# Altium project BrushMotor6_DEMO_0.PrjPcb
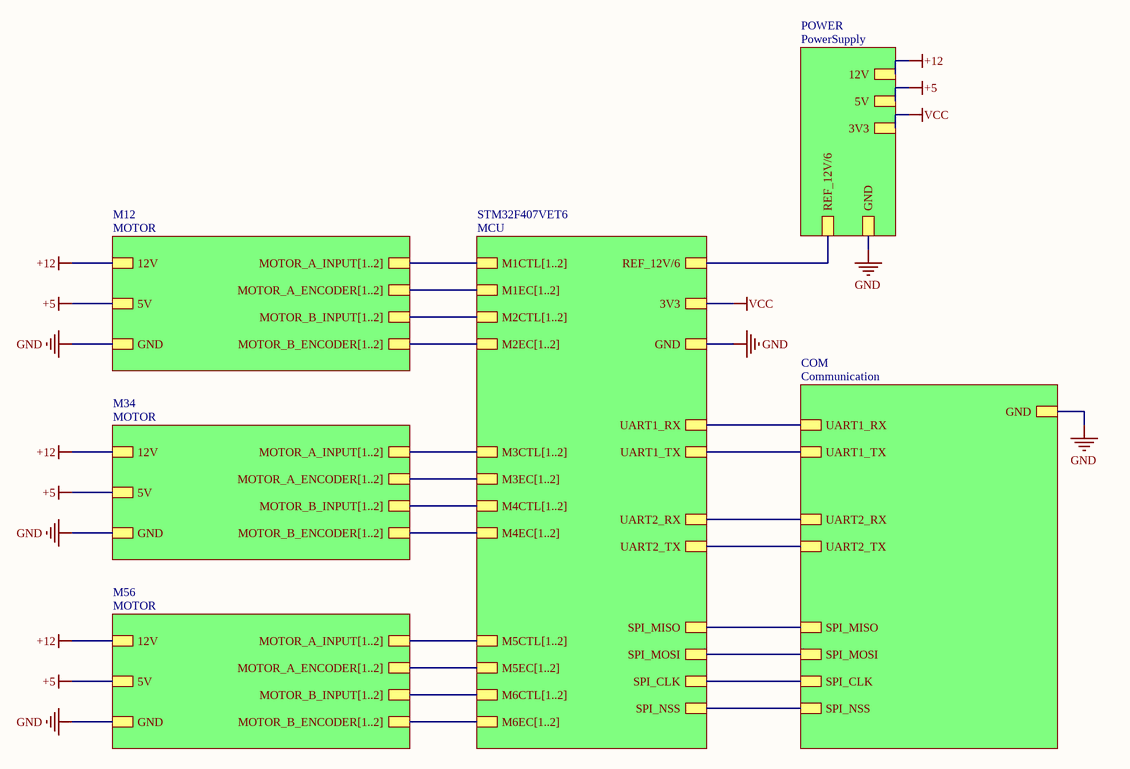
[diagram p0: Top.SchDoc]
5 sheets, 101 parts. Net scope: hierarchical (ports join the sheet entries above them; power ports are global).
Board file: PCB1.PcbDoc
Sheets:
  Top.SchDoc
    POWER = PowerSupply.SchDoc
    STM32F407VET6 = MCU.SchDoc
    M12 = MOTOR.SchDoc
    COM = Communication.SchDoc
    M34 = MOTOR.SchDoc
    M56 = MOTOR.SchDoc

## Sheet Top.SchDoc
size A4; SheetNumber: 1; SheetTotal: 5

### Sub-sheets
COM = Communication: UART1_RX, UART1_TX, UART2_RX, UART2_TX, SPI_MISO, SPI_MOSI, SPI_CLK, SPI_NSS, GND
M12 = MOTOR: 12V, GND, MOTOR_A_INPUT[1..2], MOTOR_A_ENCODER[1..2], 5V, MOTOR_B_ENCODER[1..2], MOTOR_B_INPUT[1..2]
M34 = MOTOR: 12V, GND, MOTOR_A_INPUT[1..2], MOTOR_A_ENCODER[1..2], 5V, MOTOR_B_ENCODER[1..2], MOTOR_B_INPUT[1..2]
M56 = MOTOR: 12V, GND, MOTOR_A_INPUT[1..2], MOTOR_A_ENCODER[1..2], 5V, MOTOR_B_ENCODER[1..2], MOTOR_B_INPUT[1..2]
POWER = PowerSupply: 12V, 5V, 3V3, GND, REF_12V/6
STM32F407VET6 = MCU: 3V3, GND, M1CTL[1..2], M1EC[1..2], M2CTL[1..2], M2EC[1..2], REF_12V/6, M3CTL[1..2], M3EC[1..2], M4CTL[1..2], M4EC[1..2], M5CTL[1..2], M5EC[1..2], M6CTL[1..2], M6EC[1..2], UART1_RX, UART1_TX, UART2_RX, UART2_TX, SPI_MISO, SPI_MOSI, SPI_CLK, SPI_NSS

### Nets
+5: sheet POWER/5V, sheet M12/5V, sheet M34/5V, sheet M56/5V
+12: sheet POWER/12V, sheet M12/12V, sheet M34/12V, sheet M56/12V
GND: sheet POWER/GND, sheet STM32F407VET6/GND, sheet M12/GND, sheet COM/GND, sheet M34/GND, sheet M56/GND
VCC: sheet POWER/3V3, sheet STM32F407VET6/3V3
REF_12V/6: sheet POWER/REF_12V/6, sheet STM32F407VET6/REF_12V/6
SPI_CLK: sheet STM32F407VET6/SPI_CLK, sheet COM/SPI_CLK
SPI_MISO: sheet STM32F407VET6/SPI_MISO, sheet COM/SPI_MISO
SPI_MOSI: sheet STM32F407VET6/SPI_MOSI, sheet COM/SPI_MOSI
SPI_NSS: sheet STM32F407VET6/SPI_NSS, sheet COM/SPI_NSS
UART1_RX: sheet STM32F407VET6/UART1_RX, sheet COM/UART1_RX
UART1_TX: sheet STM32F407VET6/UART1_TX, sheet COM/UART1_TX
UART2_RX: sheet STM32F407VET6/UART2_RX, sheet COM/UART2_RX
UART2_TX: sheet STM32F407VET6/UART2_TX, sheet COM/UART2_TX

### Buses and harness runs
bus sheet M12/MOTOR_A_ENCODER[1..2] = sheet STM32F407VET6/M1EC[1..2]
bus sheet M12/MOTOR_A_INPUT[1..2] = sheet STM32F407VET6/M1CTL[1..2]
bus sheet M12/MOTOR_B_ENCODER[1..2] = sheet STM32F407VET6/M2EC[1..2]
bus sheet M12/MOTOR_B_INPUT[1..2] = sheet STM32F407VET6/M2CTL[1..2]
bus sheet M34/MOTOR_A_ENCODER[1..2] = sheet STM32F407VET6/M3EC[1..2]
bus sheet M34/MOTOR_A_INPUT[1..2] = sheet STM32F407VET6/M3CTL[1..2]
bus sheet M34/MOTOR_B_ENCODER[1..2] = sheet STM32F407VET6/M4EC[1..2]
bus sheet M34/MOTOR_B_INPUT[1..2] = sheet STM32F407VET6/M4CTL[1..2]
bus sheet M56/MOTOR_A_ENCODER[1..2] = sheet STM32F407VET6/M5EC[1..2]
bus sheet M56/MOTOR_A_INPUT[1..2] = sheet STM32F407VET6/M5CTL[1..2]
bus sheet M56/MOTOR_B_ENCODER[1..2] = sheet STM32F407VET6/M6EC[1..2]
bus sheet M56/MOTOR_B_INPUT[1..2] = sheet STM32F407VET6/M6CTL[1..2]

## Sheet PowerSupply.SchDoc
size 457 x 127 mm; SheetNumber: 2; SheetTotal: 5
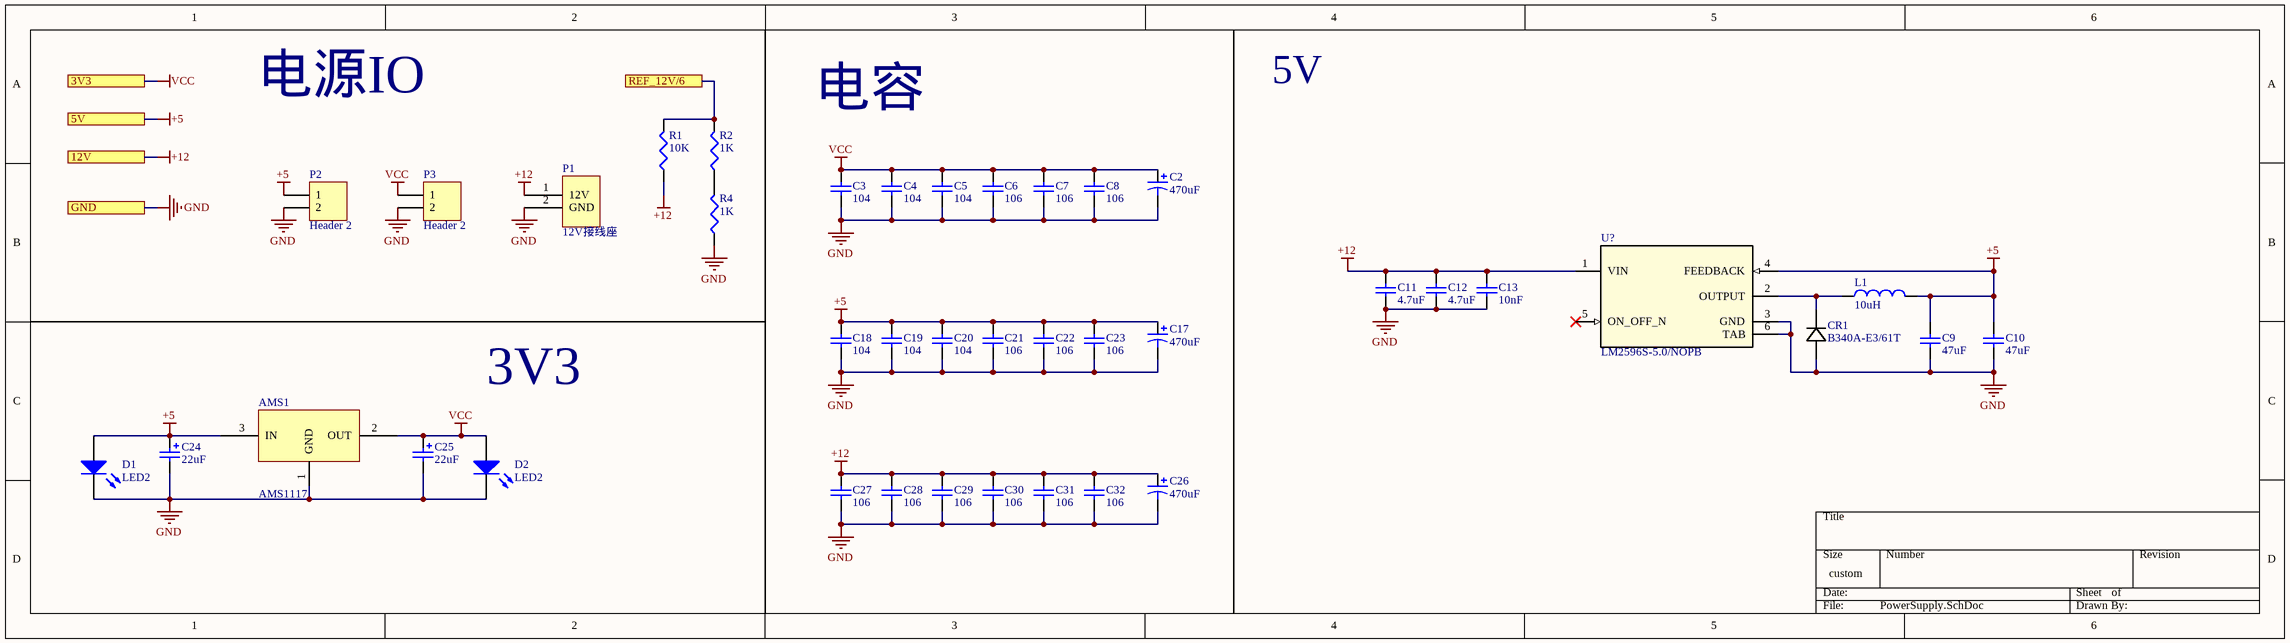
[diagram p1: PowerSupply.SchDoc]

### Parts
AMS1  AMS1117  [AMS1117]
C2  470uF  [电解电容10*10.5mm]
C3  104  [MY0805]
C4  104  [MY0805]
C5  104  [MY0805]
C6  106  [MY0805]
C7  106  [MY0805]
C8  106  [MY0805]
C9  47uF  [MY0805]
C10  47uF  [MY0805]
C11  4.7uF  [MY0805]
C12  4.7uF  [MY0805]
C13  10nF  [MY0805]
C17  470uF  [电解电容10*10.5mm]
C18  104  [MY0805]
C19  104  [MY0805]
C20  104  [MY0805]
C21  106  [MY0805]
C22  106  [MY0805]
C23  106  [MY0805]
C24  22uF  [MY0805]
C25  22uF  [MY0805]
C26  470uF  [电解电容10*10.5mm]
C27  106  [MY0805]
C28  106  [MY0805]
C29  106  [MY0805]
C30  106  [MY0805]
C31  106  [MY0805]
C32  106  [MY0805]
CR1  B340A-E3/61T  [DO-214AC_VIS]
D1  LED2  [MY0805]
D2  LED2  [MY0805]
L1  10uH  [电感0603_10uH]
P1  12V接线座  [16A_5.0mm接线座]
P2  Header 2  [POWER_PORT]
P3  Header 2  [POWER_PORT]
R1  10K  [MY0805]
R2  1K  [MY0805]
R4  1K  [MY0805]
U?  LM2596S-5.0/NOPB  [KTT0005B]

### Ports
3V3, 5V, 12V, GND, REF_12V/6

### Nets
+5: AMS1.3(IN) C9.2 C10.2 C17.1 C18.2 C19.2 C20.2 C21.2 C22.2 C23.2 C24.1 D1.1(A) L1.2 P2.1 U?.4(FEEDBACK) ; port 5V
+12: C11.2 C12.2 C13.2 C26.1 C27.2 C28.2 C29.2 C30.2 C31.2 C32.2 P1.1(12V) R1.1 U?.1(VIN) ; port 12V
GND: AMS1.1(GND) C2.2 C3.1 C4.1 C5.1 C6.1 C7.1 C8.1 C9.1 C10.1 C11.1 C12.1 C13.1 C17.2 C18.1 C19.1 C20.1 C21.1 C22.1 C23.1 C24.2 C25.2 C26.2 C27.1 C28.1 C29.1 C30.1 C31.1 C32.1 CR1.2 D1.2(K) D2.2(K) P1.2(GND) P2.2 P3.2 R4.1 U?.3(GND) U?.6(TAB) ; port GND
VCC: AMS1.2(OUT) C2.1 C3.2 C4.2 C5.2 C6.2 C7.2 C8.2 C25.1 D2.1(A) P3.1 ; port 3V3
REF_12V/6: R1.2 R2.2 ; port REF_12V/6
NetCR1_1: CR1.1 L1.1 U?.2(OUTPUT)
NetR2_1: R2.1 R4.2

Not connected (* = marked no-connect by the designer): U? 5(ON_OFF_N)*

### Notes on the sheet
- 5V
- 电源IO
- 电容
- 3V3

### Library data of the parts
C2 C17 C26 = Cap Pol1: Polarized Capacitor (Radial); Value: 100pF; Published: 8-Jun-2000; LatestRevisionDate: 17-Jul-2002; LatestRevisionNote: Re-released for DXP Platform.; PackageReference: RB7.6-15; Publisher: Altium Limited; PackageDescription: Polarized Capacitor (Radial); 2 Leads
C3-C5 C11 C12 C21-C23 C27-C32 = Cap: Capacitor; Published: 8-Jun-2000; LatestRevisionDate: 17-Jul-2002; LatestRevisionNote: Re-released for DXP Platform.; PackageReference: RAD-0.3; Publisher: Altium Limited; PackageDescription: Radial Cap, Thru-Hole; 2 Leads; 0.3 in Pin Spacing
  C3-C5: Value: 104
  C11 C12: Value: 4.7uF
  C21-C23 C27-C32: Value: 106
C6-C8 = Cap: Capacitor; Value: 104; Published: 8-Jun-2000; LatestRevisionDate: 17-Jul-2002; LatestRevisionNote: Re-released for DXP Platform.; PackageReference: RAD-0.3; Publisher: Altium Limited; PackageDescription: Radial Cap, Thru-Hole; 2 Leads; 0.3 in Pin Spacing
C9 C10 C13 = Cap: Capacitor; Value: 4.7uF; Published: 8-Jun-2000; LatestRevisionDate: 17-Jul-2002; LatestRevisionNote: Re-released for DXP Platform.; PackageReference: RAD-0.3; Publisher: Altium Limited; PackageDescription: Radial Cap, Thru-Hole; 2 Leads; 0.3 in Pin Spacing
C18-C20 = Cap: Capacitor; Value: 106; Published: 8-Jun-2000; LatestRevisionDate: 17-Jul-2002; LatestRevisionNote: Re-released for DXP Platform.; PackageReference: RAD-0.3; Publisher: Altium Limited; PackageDescription: Radial Cap, Thru-Hole; 2 Leads; 0.3 in Pin Spacing
C24 C25 = Cap Pol2: Polarized Capacitor (Axial); Published: 8-Jun-2000; LatestRevisionDate: 17-Jul-2002; LatestRevisionNote: Re-released for DXP Platform.; PackageReference: POLAR0.8; Publisher: Altium Limited; PackageDescription: Polarized Capacitor; 2 Leads; Value: 22uF
CR1 = B340A-E3/61T: No Description Available; Mfr_Name: Vishay; Type: DEV; Copyright: Copyright (C) 2022 Ultra Librarian. All rights reserved.; Manufacturer_Part_Number: B340A-E3/61T; RefDes: RefDes
D1 D2 = LED2: Typical RED, GREEN, YELLOW, AMBER GaAs LED; Published: 8-Jun-2000; LatestRevisionDate: 17-Jul-2002; LatestRevisionNote: Re-released for DXP Platform.; PackageVersion: Feb-2002; PackageReference: 3.2X1.6X1.1; Publisher: Altium Limited; PackageDescription: SM LED; 2 Flat Leads
L1 = Inductor: Code_IEC: 1005; Published: 8-Jun-2000; LatestRevisionDate: 29-May-2009; LatestRevisionNote: IPC-7351 Footprint Added.; PackageReference: 0402-A; Publisher: Altium Limited; PackageDescription: Chip Inductor; Code_JEITA: 0402; Value: 10uH
P2 P3 = Header 2: Header, 2-Pin; LatestRevisionDate: 17-Jul-2002; LatestRevisionNote: Re-released for DXP Platform.; Publisher: Altium Limited
R1 R2 R4 = Res3: Resistor; Published: 8-Jun-2000; LatestRevisionDate: 29-May-2009; LatestRevisionNote: IPC-7351 Footprint Added.; PackageReference: J1-0603; Publisher: Altium Limited; PackageDescription: Chip Resistor
  R1: Value: 10K
  R2 R4: Value: 1K
U? = LM2596S-5.0/NOPB: No Description Available; Mfr_Name: Texas Instruments; PartNumber: LM2596SX-ADJ/NOPB; Alternate_PartNumber: LM2596S-ADJ/NOPB; CompType: IC; Type: DEV; RefDes: RefDes; Copyright: Copyright (C) 2022 Ultra Librarian. All rights reserved.; Manufacturer_Part_Number: LM2596S-5.0/NOPB; PackageReference: KTT0005B; MountType: SMT; RoHS: Y; Manufacturer: Texas Instruments

## Sheet MCU.SchDoc
size A3; SheetNumber: 3; SheetTotal: 5
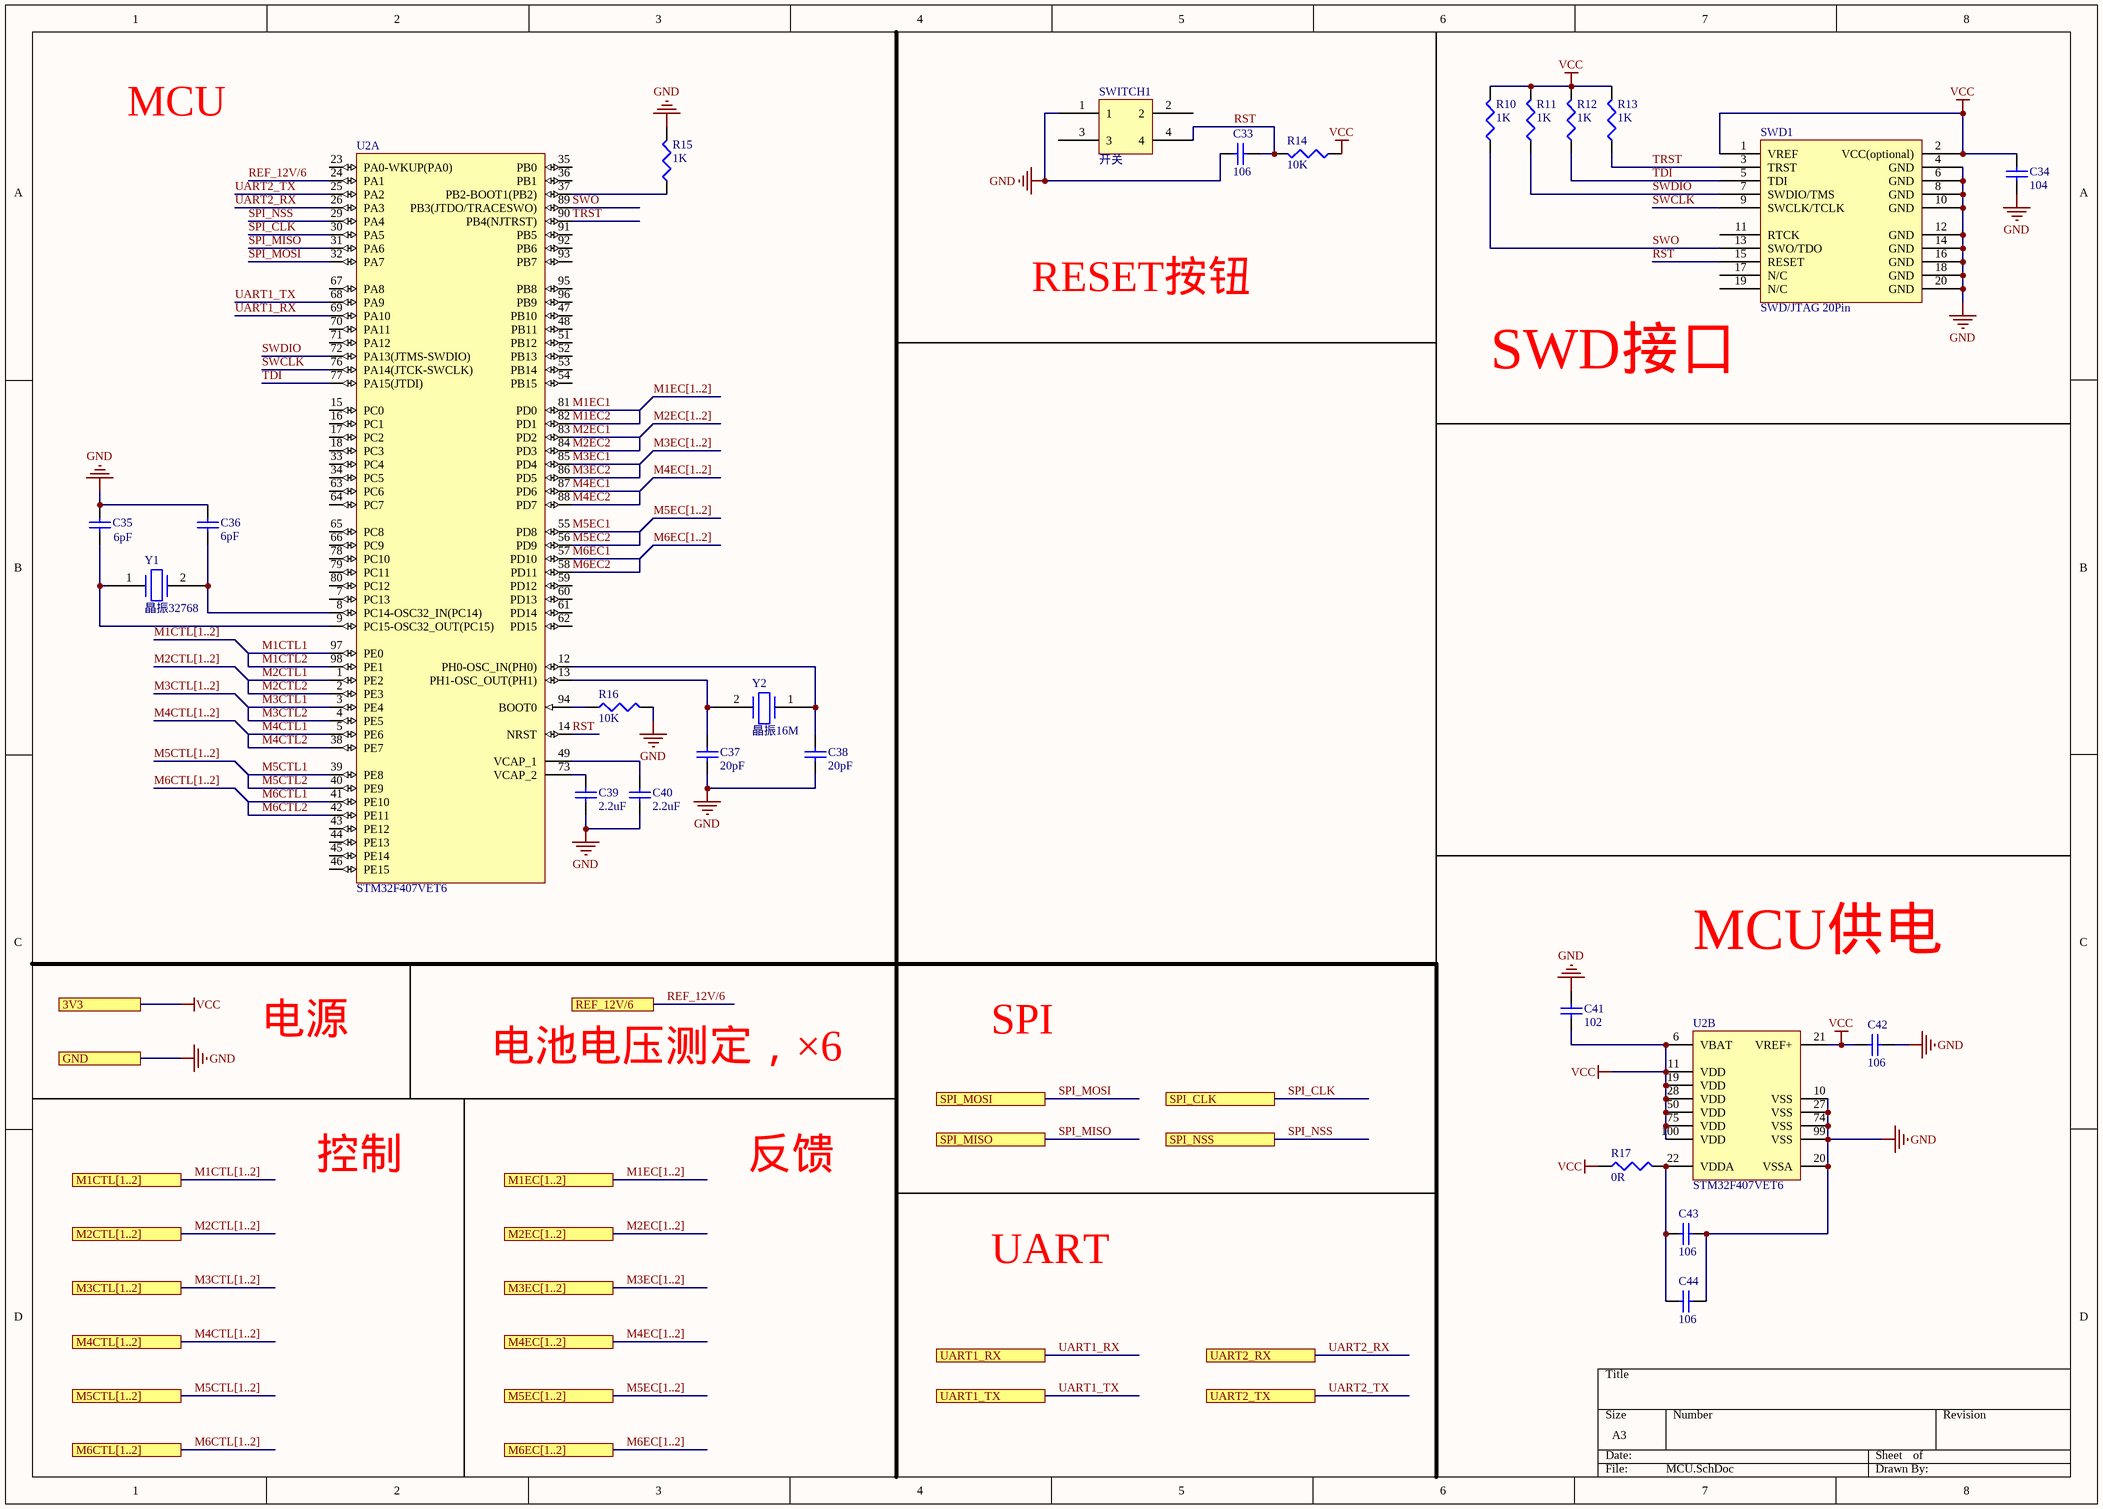
[diagram p2: MCU.SchDoc]

### Parts
C33  106  [MY0805]
C34  104  [MY0805]
C35  6pF  [MY0805]
C36  6pF  [MY0805]
C37  20pF  [MY0805]
C38  20pF  [MY0805]
C39  2.2uF  [MY0805]
C40  2.2uF  [MY0805]
C41  102  [MY0805]
C42  106  [MY0805]
C43  106  [MY0805]
C44  106  [MY0805]
R10  1K  [MY0805]
R11  1K  [MY0805]
R12  1K  [MY0805]
R13  1K  [MY0805]
R14  10K  [MY0805]
R15  1K  [MY0805]
R16  10K  [MY0805]
R17  0R  [MY0805]
SWD1  SWD/JTAG 20Pin  [SWD 20Pin]
SWITCH1  开关  [开关]
U2  STM32F407VET6  [STM-LQFP100_N]  (parts A,B of 2)
Y1  晶振32768  [晶振32768K_AT38]
Y2  晶振16M  [晶振16M]

### Ports
3V3, GND, M1CTL[1..2], M1EC[1..2], M2CTL[1..2], M2EC[1..2], M3CTL[1..2], M3EC[1..2], M4CTL[1..2], M4EC[1..2], M5CTL[1..2], M5EC[1..2], M6CTL[1..2], M6EC[1..2], REF_12V/6, SPI_CLK, SPI_MISO, SPI_MOSI, SPI_NSS, UART1_RX, UART1_TX, UART2_RX, UART2_TX

### Nets
GND: C33.1 C34.1 C35.2 C36.2 C37.2 C38.2 C39.1 C40.1 C41.1 C42.2 C43.2 C44.2 R15.2 R16.2 SWD1.4(GND) SWD1.6(GND) SWD1.8(GND) SWD1.10(GND) SWD1.12(GND) SWD1.14(GND) SWD1.16(GND) SWD1.18(GND) SWD1.20(GND) SWITCH1.1 U2.10(VSS) U2.20(VSSA) U2.27(VSS) U2.74(VSS) U2.99(VSS) ; port GND
VCC: C34.2 C41.2 C42.1 R10.2 R11.2 R12.2 R13.2 R14.1 R17.1 SWD1.1(VREF) SWD1.2(VCC(optional)) U2.6(VBAT) U2.11(VDD) U2.19(VDD) U2.21(VREF+) U2.28(VDD) U2.50(VDD) U2.75(VDD) U2.100(VDD) ; port 3V3
M1CTL1: U2.97(PE0)
M1CTL2: U2.98(PE1)
M1EC1: U2.81(PD0)
M1EC2: U2.82(PD1)
M2CTL1: U2.1(PE2)
M2CTL2: U2.2(PE3)
M2EC1: U2.83(PD2)
M2EC2: U2.84(PD3)
M3CTL1: U2.3(PE4)
M3CTL2: U2.4(PE5)
M3EC1: U2.85(PD4)
M3EC2: U2.86(PD5)
M4CTL1: U2.5(PE6)
M4CTL2: U2.38(PE7)
M4EC1: U2.87(PD6)
M4EC2: U2.88(PD7)
M5CTL1: U2.39(PE8)
M5CTL2: U2.40(PE9)
M5EC1: U2.55(PD8)
M5EC2: U2.56(PD9)
M6CTL1: U2.41(PE10)
M6CTL2: U2.42(PE11)
M6EC1: U2.57(PD10)
M6EC2: U2.58(PD11)
REF_12V/6: U2.24(PA1) ; port REF_12V/6
RST: C33.2 R14.2 SWD1.15(RESET) SWITCH1.4 U2.14(NRST)
SPI_CLK: U2.30(PA5) ; port SPI_CLK
SPI_MISO: U2.31(PA6) ; port SPI_MISO
SPI_MOSI: U2.32(PA7) ; port SPI_MOSI
SPI_NSS: U2.29(PA4) ; port SPI_NSS
SWCLK: SWD1.9(SWCLK/TCLK) U2.76(PA14(JTCK-SWCLK))
SWDIO: R11.1 SWD1.7(SWDIO/TMS) U2.72(PA13(JTMS-SWDIO))
SWO: R10.1 SWD1.13(SWO/TDO) U2.89(PB3(JTDO/TRACESWO))
TDI: R12.1 SWD1.5(TDI) U2.77(PA15(JTDI))
TRST: R13.1 SWD1.3(TRST) U2.90(PB4(NJTRST))
UART1_RX: U2.69(PA10) ; port UART1_RX
UART1_TX: U2.68(PA9) ; port UART1_TX
UART2_RX: U2.26(PA3) ; port UART2_RX
UART2_TX: U2.25(PA2) ; port UART2_TX
NetC35_1: C35.1 U2.9(PC15-OSC32_OUT(PC15)) Y1.1
NetC36_1: C36.1 U2.8(PC14-OSC32_IN(PC14)) Y1.2
NetC37_1: C37.1 U2.13(PH1-OSC_OUT(PH1)) Y2.2
NetC38_1: C38.1 U2.12(PH0-OSC_IN(PH0)) Y2.1
NetC39_2: C39.2 U2.73(VCAP_2)
NetC40_2: C40.2 U2.49(VCAP_1)
NetC43_1: C43.1 C44.1 R17.2 U2.22(VDDA)
NetR15_1: R15.1 U2.37(PB2-BOOT1(PB2))
NetR16_1: R16.1 U2.94(BOOT0)

Not connected (* = marked no-connect by the designer): SWD1 11(RTCK) 17(N/C) 19(N/C); SWITCH1 2 3; U2 7(PC13) 15(PC0) 16(PC1) 17(PC2) 18(PC3) 23(PA0-WKUP(PA0)) 33(PC4) 34(PC5) 35(PB0) 36(PB1) 43(PE12) 44(PE13) 45(PE14) 46(PE15) 47(PB10) 48(PB11) 51(PB12) 52(PB13) 53(PB14) 54(PB15) 59(PD12) 60(PD13) 61(PD14) 62(PD15) 63(PC6) 64(PC7) 65(PC8) 66(PC9) 67(PA8) 70(PA11) 71(PA12) 78(PC10) 79(PC11) 80(PC12) 91(PB5) 92(PB6) 93(PB7) 95(PB8) 96(PB9)

### Buses and harness runs
bus M1CTL[1..2]
bus M1CTL[1..2] = port M1CTL[1..2]
bus M1EC[1..2]
bus M1EC[1..2] = port M1EC[1..2]
bus M2CTL[1..2]
bus M2CTL[1..2] = port M2CTL[1..2]
bus M2EC[1..2]
bus M2EC[1..2] = port M2EC[1..2]
bus M3CTL[1..2]
bus M3CTL[1..2] = port M3CTL[1..2]
bus M3EC[1..2]
bus M3EC[1..2] = port M3EC[1..2]
bus M4CTL[1..2]
bus M4CTL[1..2] = port M4CTL[1..2]
bus M4EC[1..2]
bus M4EC[1..2] = port M4EC[1..2]
bus M5CTL[1..2]
bus M5CTL[1..2] = port M5CTL[1..2]
bus M5EC[1..2]
bus M5EC[1..2] = port M5EC[1..2]
bus M6CTL[1..2]
bus M6CTL[1..2] = port M6CTL[1..2]
bus M6EC[1..2]
bus M6EC[1..2] = port M6EC[1..2]

### Notes on the sheet
- MCU
- RESET按钮
- SWD接口
- MCU供电
- 电源
- SPI
- 电池电压测定，×6
- 控制
- 反馈
- UART

### Library data of the parts
C33 C34 C37-C44 = Cap: Capacitor; Published: 8-Jun-2000; LatestRevisionDate: 17-Jul-2002; LatestRevisionNote: Re-released for DXP Platform.; PackageReference: RAD-0.3; Publisher: Altium Limited; PackageDescription: Radial Cap, Thru-Hole; 2 Leads; 0.3 in Pin Spacing
  C33 C42-C44: Value: 106
  C34: Value: 104
  C37 C38: Value: 20PF
  C39 C40: Value: 2.2uF
  C41: Value: 102
C35 C36 = Cap: Capacitor; Value: 20PF; Published: 8-Jun-2000; LatestRevisionDate: 17-Jul-2002; LatestRevisionNote: Re-released for DXP Platform.; PackageReference: RAD-0.3; Publisher: Altium Limited; PackageDescription: Radial Cap, Thru-Hole; 2 Leads; 0.3 in Pin Spacing
R10-R17 = Res3: Resistor; Published: 8-Jun-2000; LatestRevisionDate: 29-May-2009; LatestRevisionNote: IPC-7351 Footprint Added.; PackageReference: J1-0603; Publisher: Altium Limited; PackageDescription: Chip Resistor
  R10-R13 R15: Value: 1K
  R14 R16: Value: 10K
  R17: Value: 0R
U2 = STM32F407VET6: ARM Cortex-M4 32-bit MCU+FPU, 210 DMIPS, 512 kB Flash, 192 kB Internal RAM, 82 I/Os, 100-pin LQFP, -40 to 85 degC, Tray; Manufacturer: STMicroelectronics; D/A Converter: 2x12-bit; FLASH Size (Prog) (kB): 512; I/Os (High Current): 82; Internal RAM Size (kB): 192; Operating Frequency(F) (Processor speed) (MHz): 168; Supply Voltage(Vcc) max (V): 3.6; Supply Voltage(Vcc) min (V): 1.8; DatasheetVersion: Rev. 4; PackageVersion: Rev. 1, 06/2013; PackageReference: LQFP100; PackageDescription: 100-Pin Low Profile Quad Flat Package, 14 x 14 mm Body, 0.5 mm Pitch; Supplier 1: Digi-Key; Supplier Part Number 1: 497-12075-ND; Supplier 2: Farnell; Supplier Part Number 2: 2064367; Supplier 3: Newark; Supplier Part Number 3: 73T2332; Supplier 4: Mouser; Supplier Part Number 4: 511-STM32F407VET6; Core: ARM Cortex-M4; Packing: Tray; Mounting Technology: Surface Mount; PartNumber: STM32F407VET6; ComponentLink1Description: Manufacturer URL; ComponentLink1URL: http://www.st.com/web/en/home.html; ComponentLink2Description: Datasheet; ComponentLink2URL: http://www.st.com/st-web-ui/static/active/en/resource/technical/document/datasheet/DM00037051.pdf; ComponentLink3Description: Package Specification; ComponentLink3URL: http://www.st.com/st-web-ui/static/active/en/resource/technical/document/data_brief/DM00071938.pdf
Y1 Y2 = 晶振

## Sheet MOTOR.SchDoc
size 203 x 203 mm; SheetNumber: 4; SheetTotal: 5
Used 3 times, as channels M12, M34, M56. Parts and nets are listed once, with the designators drawn on the sheet.
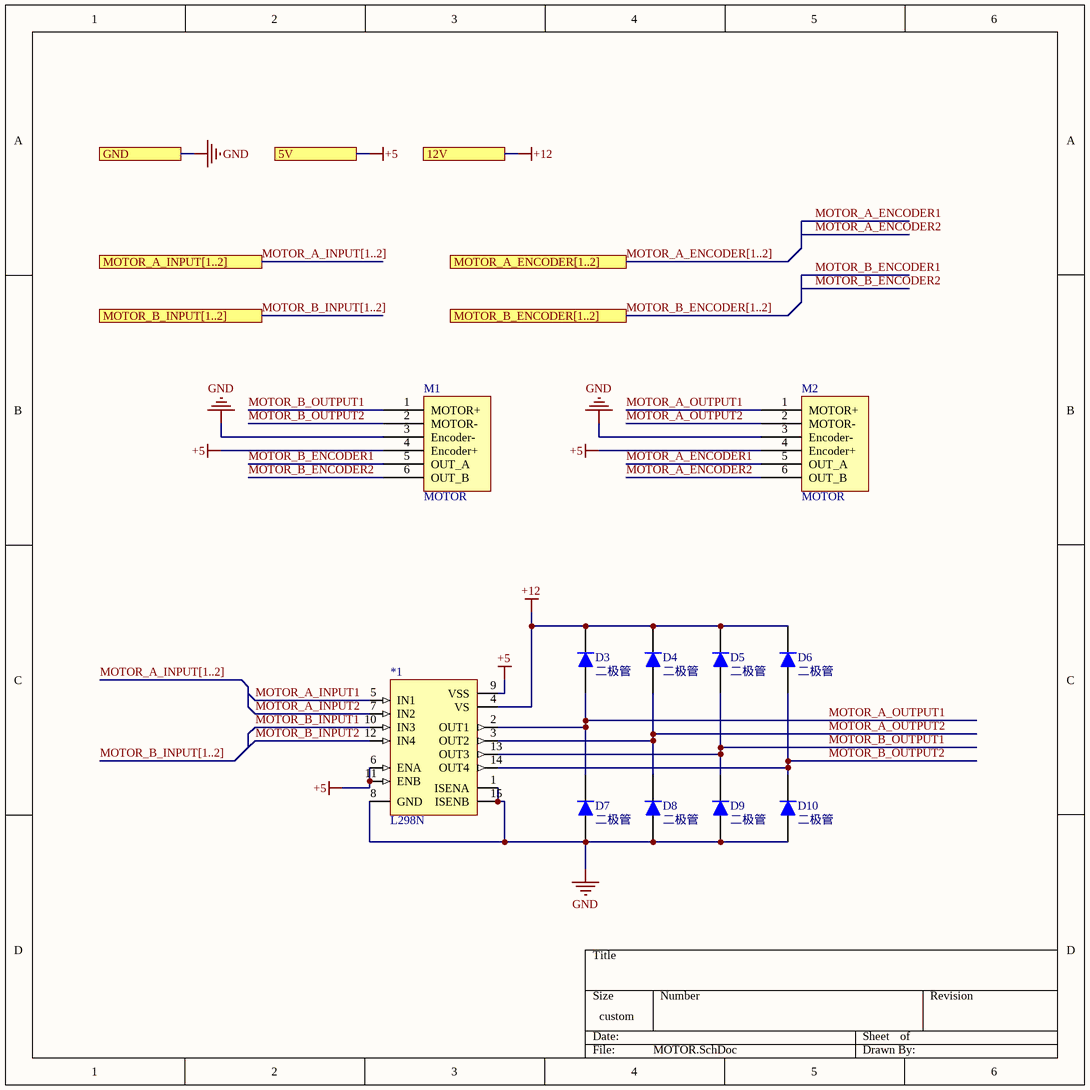
[diagram p3: MOTOR.SchDoc]

### Parts
*1  L298N  [L298N-DIP]
D3  二极管  [SOD-323]
D4  二极管  [SOD-323]
D5  二极管  [SOD-323]
D6  二极管  [SOD-323]
D7  二极管  [SOD-323]
D8  二极管  [SOD-323]
D9  二极管  [SOD-323]
D10  二极管  [SOD-323]
M1  MOTOR  [MOTOR_PORT ClearVer]
M2  MOTOR  [MOTOR_PORT ClearVer]

### Ports
5V, 12V, GND, MOTOR_A_ENCODER[1..2], MOTOR_A_INPUT[1..2], MOTOR_B_ENCODER[1..2], MOTOR_B_INPUT[1..2]

### Nets
+5: *1.6(ENA) *1.9(VSS) *1.11(ENB) M1.4(Encoder+) M2.4(Encoder+) ; port 5V
+12: *1.4(VS) D3.1 D4.1 D5.1 D6.1 ; port 12V
GND: *1.1(ISENA) *1.8(GND) *1.15(ISENB) D7.2 D8.2 D9.2 D10.2 M1.3(Encoder-) M2.3(Encoder-) ; port GND
MOTOR_A_ENCODER1: M2.5(OUT_A)
MOTOR_A_ENCODER2: M2.6(OUT_B)
MOTOR_A_INPUT1: *1.5(IN1)
MOTOR_A_INPUT2: *1.7(IN2)
MOTOR_A_OUTPUT1: *1.2(OUT1) D3.2 D7.1 M2.1(MOTOR+)
MOTOR_A_OUTPUT2: *1.3(OUT2) D4.2 D8.1 M2.2(MOTOR-)
MOTOR_B_ENCODER1: M1.5(OUT_A)
MOTOR_B_ENCODER2: M1.6(OUT_B)
MOTOR_B_INPUT1: *1.10(IN3)
MOTOR_B_INPUT2: *1.12(IN4)
MOTOR_B_OUTPUT1: *1.13(OUT3) D5.2 D9.1 M1.1(MOTOR+)
MOTOR_B_OUTPUT2: *1.14(OUT4) D6.2 D10.1 M1.2(MOTOR-)

### Channels
M12: designators end in _M12; ports 5V=+5 12V=+12 GND=GND
M34: designators end in _M34; ports 5V=+5 12V=+12 GND=GND
M56: designators end in _M56; ports 5V=+5 12V=+12 GND=GND

### Buses and harness runs
bus MOTOR_A_ENCODER[1..2] = port MOTOR_A_ENCODER[1..2]
bus MOTOR_A_INPUT[1..2]
bus MOTOR_A_INPUT[1..2] = port MOTOR_A_INPUT[1..2]
bus MOTOR_B_ENCODER[1..2] = port MOTOR_B_ENCODER[1..2]
bus MOTOR_B_INPUT[1..2]
bus MOTOR_B_INPUT[1..2] = port MOTOR_B_INPUT[1..2]

### Library data of the parts
D3-D10 = 二极管 SOD323
M1 M2 = MOTOR_Port

## Sheet Communication.SchDoc
size 101 x 152 mm; SheetNumber: 5; SheetTotal: 5
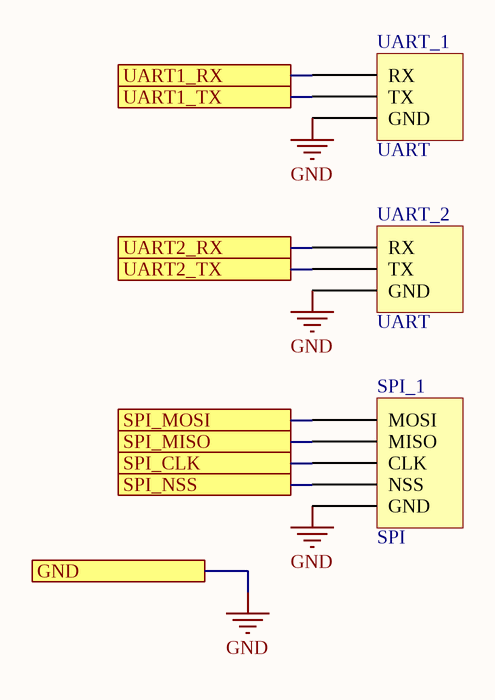
[diagram p4: Communication.SchDoc]

### Parts
SPI_1  SPI  [SPI]
UART_1  UART  [UART]
UART_2  UART  [UART]

### Ports
GND, SPI_CLK, SPI_MISO, SPI_MOSI, SPI_NSS, UART1_RX, UART1_TX, UART2_RX, UART2_TX

### Nets
GND: SPI_1.1(GND) UART_1.1(GND) UART_2.1(GND) ; port GND
SPI_CLK: SPI_1.4(CLK) ; port SPI_CLK
SPI_MISO: SPI_1.3(MISO) ; port SPI_MISO
SPI_MOSI: SPI_1.2(MOSI) ; port SPI_MOSI
SPI_NSS: SPI_1.5(NSS) ; port SPI_NSS
UART1_RX: UART_1.2(RX) ; port UART1_RX
UART1_TX: UART_1.3(TX) ; port UART1_TX
UART2_RX: UART_2.2(RX) ; port UART2_RX
UART2_TX: UART_2.3(TX) ; port UART2_TX

## Nets that join several sheets
+5: PowerSupply (15 pins), M12 (5 pins), M34 (5 pins), M56 (5 pins)
+12: PowerSupply (13 pins), M12 (5 pins), M34 (5 pins), M56 (5 pins)
GND: PowerSupply (38 pins), MCU (29 pins), M12 (9 pins), Communication (SPI_1.1 UART_1.1 UART_2.1), M34 (9 pins), M56 (9 pins)
VCC: PowerSupply (11 pins), MCU (19 pins)
M1CTL1: MCU (U2.97), M12 (*1_M12.5)
M1CTL2: MCU (U2.98), M12 (*1_M12.7)
M1EC1: MCU (U2.81), M12 (M2_M12.5)
M1EC2: MCU (U2.82), M12 (M2_M12.6)
M2CTL1: MCU (U2.1), M12 (*1_M12.10)
M2CTL2: MCU (U2.2), M12 (*1_M12.12)
M2EC1: MCU (U2.83), M12 (M1_M12.5)
M2EC2: MCU (U2.84), M12 (M1_M12.6)
M3CTL1: MCU (U2.3), M34 (*1_M34.5)
M3CTL2: MCU (U2.4), M34 (*1_M34.7)
M3EC1: MCU (U2.85), M34 (M2_M34.5)
M3EC2: MCU (U2.86), M34 (M2_M34.6)
M4CTL1: MCU (U2.5), M34 (*1_M34.10)
M4CTL2: MCU (U2.38), M34 (*1_M34.12)
M4EC1: MCU (U2.87), M34 (M1_M34.5)
M4EC2: MCU (U2.88), M34 (M1_M34.6)
M5CTL1: MCU (U2.39), M56 (*1_M56.5)
M5CTL2: MCU (U2.40), M56 (*1_M56.7)
M5EC1: MCU (U2.55), M56 (M2_M56.5)
M5EC2: MCU (U2.56), M56 (M2_M56.6)
M6CTL1: MCU (U2.41), M56 (*1_M56.10)
M6CTL2: MCU (U2.42), M56 (*1_M56.12)
M6EC1: MCU (U2.57), M56 (M1_M56.5)
M6EC2: MCU (U2.58), M56 (M1_M56.6)
REF_12V/6: PowerSupply (R1.2 R2.2), MCU (U2.24)
SPI_CLK: MCU (U2.30), Communication (SPI_1.4)
SPI_MISO: MCU (U2.31), Communication (SPI_1.3)
SPI_MOSI: MCU (U2.32), Communication (SPI_1.2)
SPI_NSS: MCU (U2.29), Communication (SPI_1.5)
UART1_RX: MCU (U2.69), Communication (UART_1.2)
UART1_TX: MCU (U2.68), Communication (UART_1.3)
UART2_RX: MCU (U2.26), Communication (UART_2.2)
UART2_TX: MCU (U2.25), Communication (UART_2.3)